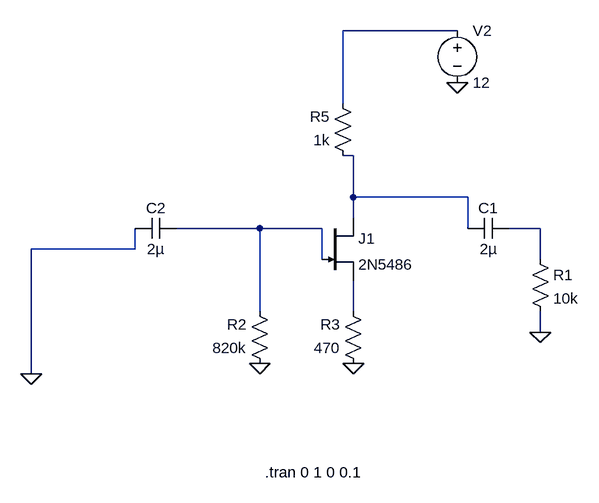
[diagram p0: schematic Draft2.asc]
Draft2.asc, the LTspice schematic file:
Version 4
SHEET 1 1012 680
WIRE 528 -128 352 -128
WIRE 352 -16 352 -128
WIRE 368 64 352 64
WIRE 368 128 368 64
WIRE 544 128 368 128
WIRE 368 160 368 128
WIRE 224 176 96 176
WIRE 320 176 224 176
WIRE 544 176 544 128
WIRE 656 176 608 176
WIRE 32 208 32 176
WIRE 32 208 -128 208
WIRE 320 224 320 176
WIRE 656 224 656 176
WIRE 224 304 224 176
WIRE 368 304 368 256
WIRE 656 336 656 304
WIRE -128 400 -128 208
FLAG 656 336 0
FLAG 368 384 0
FLAG 224 384 0
FLAG -128 400 0
FLAG 528 -48 0
SYMBOL res 240 400 R180
WINDOW 0 36 76 Left 2
WINDOW 3 36 40 Left 2
SYMATTR InstName R2
SYMATTR Value 820k
SYMBOL res 384 400 R180
WINDOW 0 36 76 Left 2
WINDOW 3 36 40 Left 2
SYMATTR InstName R3
SYMATTR Value 470
SYMBOL res 368 80 R180
WINDOW 0 36 76 Left 2
WINDOW 3 36 40 Left 2
SYMATTR InstName R5
SYMATTR Value 1k
SYMBOL cap 608 160 R90
WINDOW 0 0 32 VBottom 2
WINDOW 3 32 32 VTop 2
SYMATTR InstName C1
SYMATTR Value 2µ
SYMBOL cap 96 160 R90
WINDOW 0 0 32 VBottom 2
WINDOW 3 32 32 VTop 2
SYMATTR InstName C2
SYMATTR Value 2µ
SYMBOL njf 320 160 R0
SYMATTR InstName J1
SYMATTR Value 2N5486
SYMBOL voltage 528 -144 R0
SYMATTR InstName V2
SYMATTR Value 12
SYMBOL res 640 208 R0
SYMATTR InstName R1
SYMATTR Value 10k
TEXT 232 552 Left 2 !.tran 0 1 0 0.1

The netlist it stands for:
* Draft2.asc
R2 0 N003 820k
R3 0 N005 470
R5 N002 N001 1k
C1 N004 N002 2µ
C2 N003 0 2µ
J1 N002 N003 N005 2N5486
V2 N001 0 12
R1 N004 0 10k
.model NJF NJF
.model PJF PJF
.lib standard.jft
.tran 0 1 0 0.1
.backanno
.end